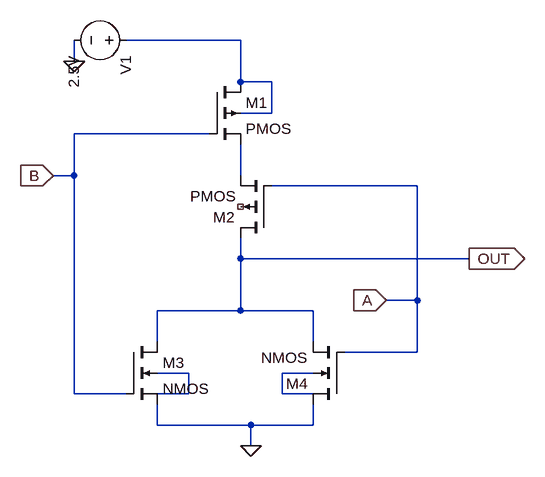
[diagram p0: schematic nor1x2.asc]
nor1x2.asc, the LTspice schematic file:
Version 4
SHEET 1 880 680
WIRE 288 0 112 0
WIRE 32 32 32 0
WIRE 288 64 288 0
WIRE 336 64 288 64
WIRE 336 112 336 64
WIRE 336 112 288 112
WIRE 240 144 32 144
WIRE 32 208 32 144
WIRE 32 208 0 208
WIRE 288 208 288 160
WIRE 560 224 336 224
WIRE 288 336 288 304
WIRE 640 336 288 336
WIRE 560 400 560 224
WIRE 560 400 512 400
WIRE 288 416 288 336
WIRE 288 416 160 416
WIRE 400 416 288 416
WIRE 160 464 160 416
WIRE 400 464 400 416
WIRE 560 480 560 400
WIRE 560 480 448 480
WIRE 208 512 160 512
WIRE 400 512 352 512
WIRE 32 544 32 208
WIRE 112 544 32 544
WIRE 208 544 208 512
WIRE 208 544 160 544
WIRE 352 544 352 512
WIRE 400 544 352 544
WIRE 160 592 160 560
WIRE 304 592 160 592
WIRE 400 592 400 560
WIRE 400 592 304 592
WIRE 304 624 304 592
FLAG 32 32 0
FLAG 0 208 B
IOPIN 0 208 In
FLAG 512 400 A
IOPIN 512 400 In
FLAG 640 336 OUT
IOPIN 640 336 Out
FLAG 304 624 0
SYMBOL pmos4 240 64 R0
SYMATTR InstName M1
SYMATTR Value2 l=2.4u w=18u
SYMBOL pmos4 336 304 R180
WINDOW 3 55 64 Left 2
SYMATTR InstName M2
SYMATTR Value2 l=2.4u w=18u
SYMBOL nmos4 112 464 R0
SYMATTR InstName M3
SYMATTR Value2 l=2.4u w=6u
SYMBOL nmos4 448 560 R180
SYMATTR InstName M4
SYMATTR Value2 l=2.4u w=6u
SYMBOL voltage 128 0 R90
WINDOW 123 0 0 Left 2
WINDOW 39 0 0 Left 2
SYMATTR InstName V1
SYMATTR Value 2.5V

The netlist it stands for:
* nor1x2.asc
M1 N001 B N002 N001 PMOS l=2.4u w=18u
M2 OUT A N002 NC_01 PMOS l=2.4u w=18u
M3 OUT B 0 N003 NMOS l=2.4u w=6u
M4 0 A OUT N004 NMOS l=2.4u w=6u
V1 N001 0 2.5V
.model NMOS NMOS
.model PMOS PMOS
.lib standard.mos
.backanno
.end